# EAGLE design 74181 (EAGLE 9.5.0)
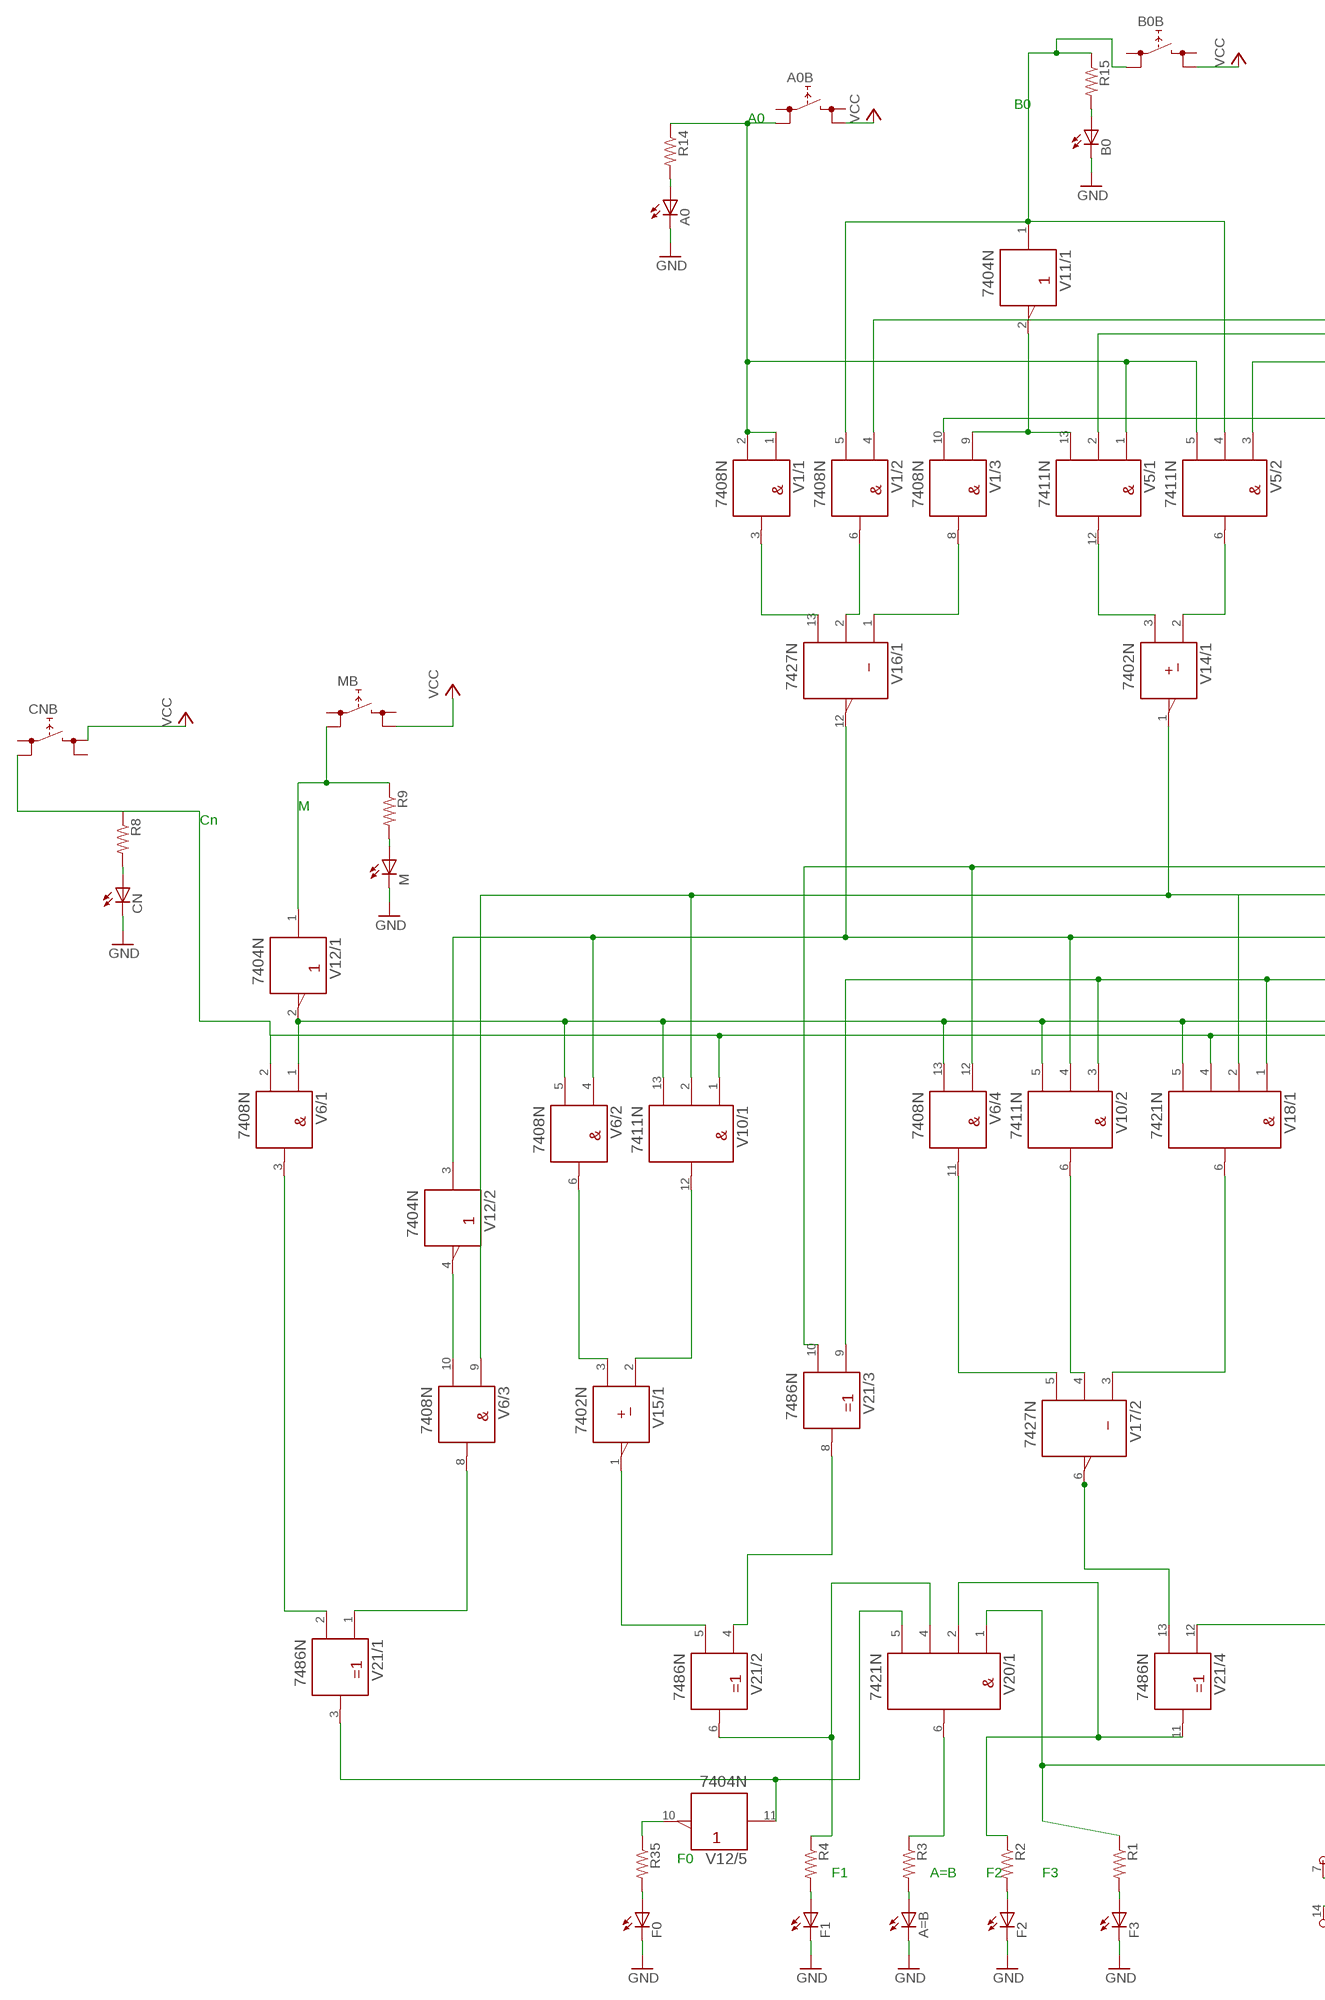
[diagram p0: schematic, sheet 1, part 1 of 2]
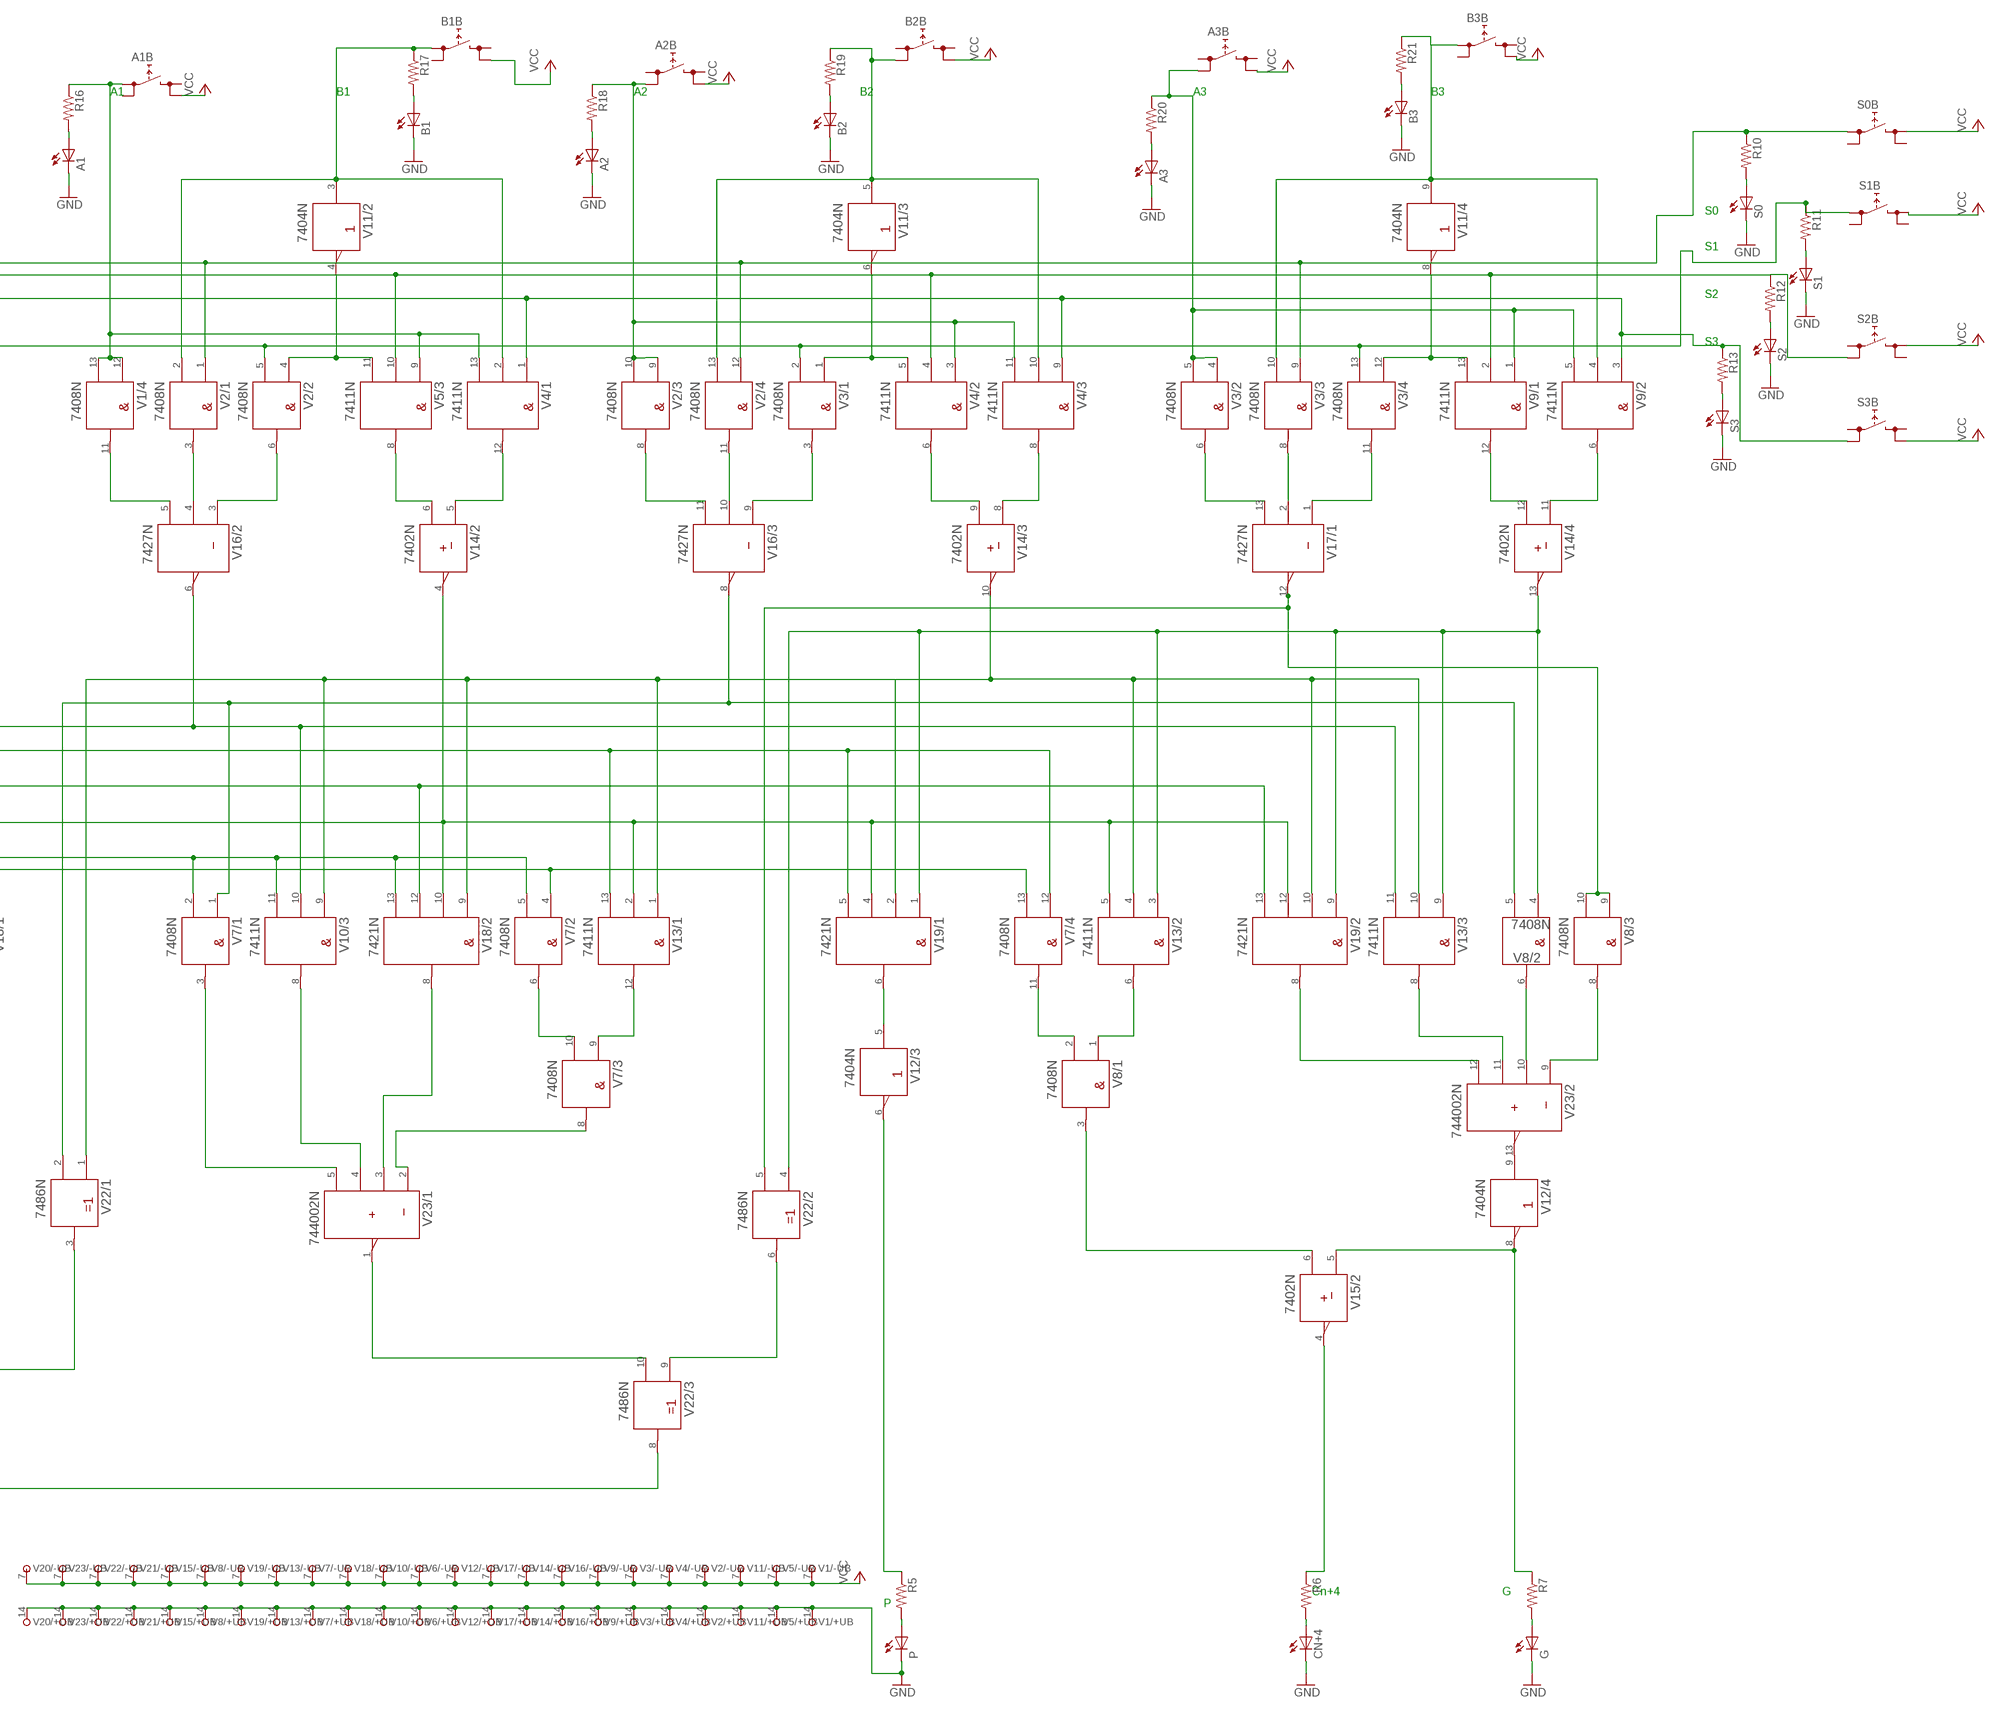
[diagram p1: schematic, sheet 1, part 2 of 2]

## Parts
A0  LEDCHIP-LED0603  [CHIP-LED0603]
A0B  REKN  [REKN]
A1  LEDCHIP-LED0603  [CHIP-LED0603]
A1B  REKN  [REKN]
A2  LEDCHIP-LED0603  [CHIP-LED0603]
A2B  REKN  [REKN]
A3  LEDCHIP-LED0603  [CHIP-LED0603]
A3B  REKN  [REKN]
A=B  LEDCHIP-LED0603  [CHIP-LED0603]
B0  LEDCHIP-LED0603  [CHIP-LED0603]
B0B  REKN  [REKN]
B1  LEDCHIP-LED0603  [CHIP-LED0603]
B1B  REKN  [REKN]
B2  LEDCHIP-LED0603  [CHIP-LED0603]
B2B  REKN  [REKN]
B3  LEDCHIP-LED0603  [CHIP-LED0603]
B3B  REKN  [REKN]
CN  LEDCHIP-LED0603  [CHIP-LED0603]
CN+4  LEDCHIP-LED0603  [CHIP-LED0603]
CNB  REKN  [REKN]
F0  LEDCHIP-LED0603  [CHIP-LED0603]
F1  LEDCHIP-LED0603  [CHIP-LED0603]
F2  LEDCHIP-LED0603  [CHIP-LED0603]
F3  LEDCHIP-LED0603  [CHIP-LED0603]
G  LEDCHIP-LED0603  [CHIP-LED0603]
M  LEDCHIP-LED0603  [CHIP-LED0603]
MB  REKN  [REKN]
P  LEDCHIP-LED0603  [CHIP-LED0603]
R1  R-US_R0603  [R0603]
R2  R-US_R0603  [R0603]
R3  R-US_R0603  [R0603]
R4  R-US_R0603  [R0603]
R5  R-US_R0603  [R0603]
R6  R-US_R0603  [R0603]
R7  R-US_R0603  [R0603]
R8  R-US_R0603  [R0603]
R9  R-US_R0603  [R0603]
R10  R-US_R0603  [R0603]
R11  R-US_R0603  [R0603]
R12  R-US_R0603  [R0603]
R13  R-US_R0603  [R0603]
R14  R-US_R0603  [R0603]
R15  R-US_R0603  [R0603]
R16  R-US_R0603  [R0603]
R17  R-US_R0603  [R0603]
R18  R-US_R0603  [R0603]
R19  R-US_R0603  [R0603]
R20  R-US_R0603  [R0603]
R21  R-US_R0603  [R0603]
R35  R-US_R0603  [R0603]
S0  LEDCHIP-LED0603  [CHIP-LED0603]
S0B  REKN  [REKN]
S1  LEDCHIP-LED0603  [CHIP-LED0603]
S1B  REKN  [REKN]
S2  LEDCHIP-LED0603  [CHIP-LED0603]
S2B  REKN  [REKN]
S3  LEDCHIP-LED0603  [CHIP-LED0603]
S3B  REKN  [REKN]
V1  7408N  [DIL14]
V2  7408N  [DIL14]
V3  7408N  [DIL14]
V4  7411N  [DIL14]
V5  7411N  [DIL14]
V6  7408N  [DIL14]
V7  7408N  [DIL14]
V8  7408N  [DIL14]
V9  7411N  [DIL14]
V10  7411N  [DIL14]
V11  7404N  [DIL14]
V12  7404N  [DIL14]
V13  7411N  [DIL14]
V14  7402N  [DIL14]
V15  7402N  [DIL14]
V16  7427N  [DIL14]
V17  7427N  [DIL14]
V18  7421N  [DIL14]
V19  7421N  [DIL14]
V20  7421N  [DIL14]
V21  7486N  [DIL14]
V22  7486N  [DIL14]
V23  744002N  [DIL14]

## Nets
!F!0: V12.11(/5:A) V20.5(/1:D) V21.3(/1:Y)
GND: A0.C A1.C A2.C A3.C A=B.C B0.C B1.C B2.C B3.C CN+4.C CN.C F0.C F1.C F2.C F3.C G.C M.C P.C S0.C S1.C S2.C S3.C V1.14(/+UB:+UB) V2.14(/+UB:+UB) V3.14(/+UB:+UB) V4.14(/+UB:+UB) V5.14(/+UB:+UB) V6.14(/+UB:+UB) V7.14(/+UB:+UB) V8.14(/+UB:+UB) V9.14(/+UB:+UB) V10.14(/+UB:+UB) V11.14(/+UB:+UB) V12.14(/+UB:+UB) V13.14(/+UB:+UB) V14.14(/+UB:+UB) V15.14(/+UB:+UB) V16.14(/+UB:+UB) V17.14(/+UB:+UB) V18.14(/+UB:+UB) V19.14(/+UB:+UB) V20.14(/+UB:+UB) V21.14(/+UB:+UB) V22.14(/+UB:+UB) V23.14(/+UB:+UB)
N$1: V1.9(/3:A) V5.13(/1:C) V11.2(/1:Y)
N$2: V2.4(/2:A) V5.11(/3:C) V11.4(/2:Y)
N$3: V3.1(/1:A) V4.5(/2:C) V11.6(/3:Y)
N$4: V3.12(/4:A) V9.13(/1:C) V11.8(/4:Y)
N$5: V1.3(/1:Y) V16.13(/1:C)
N$6: V1.6(/2:Y) V16.2(/1:B)
N$7: V1.8(/3:Y) V16.1(/1:A)
N$8: V5.12(/1:Y) V14.3(/1:B)
N$9: V5.6(/2:Y) V14.2(/1:A)
N$10: V1.11(/4:Y) V16.5(/2:C)
N$11: V2.3(/1:Y) V16.4(/2:B)
N$12: V2.6(/2:Y) V16.3(/2:A)
N$13: V5.8(/3:Y) V14.6(/2:B)
N$14: V4.12(/1:Y) V14.5(/2:A)
N$15: V2.8(/3:Y) V16.11(/3:C)
N$16: V2.11(/4:Y) V16.10(/3:B)
N$17: V3.3(/1:Y) V16.9(/3:A)
N$18: V4.6(/2:Y) V14.9(/3:B)
N$19: V4.8(/3:Y) V14.8(/3:A)
N$20: V3.6(/2:Y) V17.13(/1:C)
N$21: V3.8(/3:Y) V17.2(/1:B)
N$22: V3.11(/4:Y) V17.1(/1:A)
N$23: V9.12(/1:Y) V14.12(/4:B)
N$24: V9.6(/2:Y) V14.11(/4:A)
N$25: V6.1(/1:A) V6.5(/2:B) V6.13(/4:B) V7.2(/1:B) V7.5(/2:B) V10.5(/2:C) V10.11(/3:C) V10.13(/1:C) V12.2(/1:Y) V18.5(/1:D) V18.13(/2:D)
N$26: V6.10(/3:B) V12.4(/2:Y)
N$27: R4.1 V20.4(/1:C) V21.6(/2:Y)
N$28: F3.A R1.2
N$29: R2.1 V20.2(/1:B) V21.11(/4:Y)
N$30: R1.1 V20.1(/1:A) V22.8(/3:Y)
N$31: V7.3(/1:Y) V23.5(/1:D)
N$32: V10.8(/3:Y) V23.4(/1:C)
N$33: V18.8(/2:Y) V23.3(/1:B)
N$34: V7.8(/3:Y) V23.2(/1:A)
N$35: V7.6(/2:Y) V7.10(/3:B)
N$36: V7.9(/3:A) V13.12(/1:Y)
N$37: V22.10(/3:B) V23.1(/1:Y)
N$38: V22.6(/2:Y) V22.9(/3:A)
N$39: V12.5(/3:A) V19.6(/1:Y)
N$40: V2.9(/3:A)
N$41: V8.1(/1:A) V13.6(/2:Y)
N$42: V12.9(/4:A) V23.13(/2:Y)
N$43: R7.1 V12.8(/4:Y) V15.5(/2:A)
N$44: V8.3(/1:Y) V15.6(/2:B)
N$45: V19.8(/2:Y) V23.12(/2:D)
N$46: V13.8(/3:Y) V23.11(/2:C)
N$47: V3.4(/2:A)
N$48: V8.8(/3:Y) V23.9(/2:A)
N$49: V6.3(/1:Y) V21.2(/1:B)
N$50: V6.8(/3:Y) V21.1(/1:A)
N$51: V6.6(/2:Y) V15.3(/1:B)
N$52: V10.12(/1:Y) V15.2(/1:A)
N$53: V15.1(/1:Y) V21.5(/2:B)
N$54: V21.4(/2:A) V21.8(/3:Y)
N$55: V21.13(/4:B)
N$56: V21.12(/4:A) V22.3(/1:Y)
N$57: V6.11(/4:Y) V17.5(/2:C)
N$58: V10.6(/2:Y) V17.4(/2:B)
N$59: V17.3(/2:A) V18.6(/1:Y)
N$60: R5.1 V12.6(/3:Y)
N$61: R6.1 V15.4(/2:Y)
N$62: R3.1 V20.6(/1:Y)
N$63: V6.9(/3:A) V7.12(/4:A) V10.2(/1:B) V13.13(/1:C) V14.1(/1:Y) V18.2(/1:B) V19.5(/1:D)
N$64: CNB.0B R8.1 V6.2(/1:B) V7.4(/2:A) V7.13(/4:B) V10.1(/1:A) V18.4(/1:C)
N$65: V6.4(/2:A) V10.4(/2:B) V12.3(/2:A) V16.12(/1:Y) V18.12(/2:C) V19.13(/2:D)
N$66: V6.12(/4:A) V10.10(/3:B) V13.11(/3:C) V16.6(/2:Y) V21.10(/3:B)
N$67: V8.9(/3:A) V8.10(/3:B) V22.5(/2:B)
N$68: A0B.0B R14.1 V1.1(/1:A) V1.2(/1:B) V5.1(/1:A) V5.5(/2:C)
N$69: A1B.0A R16.1 V1.12(/4:A) V1.13(/4:B) V4.13(/1:C) V5.9(/3:A)
N$70: A2B.0B R18.1 V2.10(/3:B) V4.3(/2:A) V4.11(/3:C)
N$71: A3B.0B R20.1 V3.5(/2:B) V9.1(/1:A) V9.5(/2:C)
N$72: V10.3(/2:A) V13.2(/1:B) V13.5(/2:C) V14.4(/2:Y) V18.1(/1:A) V18.10(/2:B) V19.4(/1:C) V19.12(/2:C) V21.9(/3:A)
N$73: V7.1(/1:A) V8.5(/2:B) V16.8(/3:Y) V22.2(/1:B)
N$74: V10.9(/3:A) V13.1(/1:A) V13.4(/2:B) V13.10(/3:B) V14.10(/3:Y) V18.9(/2:A) V19.2(/1:B) V19.10(/2:B) V22.1(/1:A)
N$75: R11.1 S1B.0A V1.10(/3:B) V2.5(/2:B) V3.2(/1:B) V3.13(/4:B)
N$76: R10.1 S0B.0A V1.4(/2:A) V2.1(/1:A) V2.12(/4:A) V3.9(/3:A)
N$77: V8.4(/2:A) V13.3(/2:A) V13.9(/3:A) V14.13(/4:Y) V19.1(/1:A) V19.9(/2:A) V22.4(/2:A)
N$78: MB.0B R9.1 V12.1(/1:A)
N$79: B0B.0B R15.1 V1.5(/2:B) V5.4(/2:B) V11.1(/1:A)
N$80: B1B.0A R17.1 V2.2(/1:B) V4.2(/1:B) V11.3(/2:A)
N$81: B2B.0B R19.1 V2.13(/4:B) V4.10(/3:B) V11.5(/3:A)
N$82: B3B.0A R21.1 V3.10(/3:B) V9.4(/2:B) V11.9(/4:A)
N$83: R13.1 S3B.0B V4.1(/1:A) V4.9(/3:A) V5.3(/2:A) V9.3(/2:A)
N$84: R12.1 S2B.0B V4.4(/2:B) V5.2(/1:B) V5.10(/3:B) V9.2(/1:B)
N$85: V7.11(/4:Y) V8.2(/1:B)
N$86: V8.6(/2:Y) V23.10(/2:B)
N$87: V17.6(/2:Y) V17.12(/1:Y)
N$88: F2.A R2.2
N$89: A=B.A R3.2
N$90: F1.A R4.2
N$91: P.A R5.2
N$92: F0.A R35.2
N$93: CN+4.A R6.2
N$94: G.A R7.2
N$95: CN.A R8.2
N$96: M.A R9.2
N$97: R10.2 S0.A
N$98: R11.2 S1.A
N$99: R12.2 S2.A
N$100: R13.2 S3.A
N$101: A0.A R14.2
N$102: B0.A R15.2
N$103: A1.A R16.2
N$104: B1.A R17.2
N$105: A2.A R18.2
N$106: B2.A R19.2
N$107: A3.A R20.2
N$108: B3.A R21.2
N$109: R35.1 V12.10(/5:Y)
VCC: A0B.1B A1B.1B A2B.1B A3B.1B B0B.1B B1B.1B B2B.1B B3B.1B CNB.1A MB.1B S0B.1A S1B.1A S2B.1A S3B.1B V1.7(/-UB:-UB) V2.7(/-UB:-UB) V3.7(/-UB:-UB) V4.7(/-UB:-UB) V5.7(/-UB:-UB) V6.7(/-UB:-UB) V7.7(/-UB:-UB) V8.7(/-UB:-UB) V9.7(/-UB:-UB) V10.7(/-UB:-UB) V11.7(/-UB:-UB) V12.7(/-UB:-UB) V13.7(/-UB:-UB) V14.7(/-UB:-UB) V15.7(/-UB:-UB) V16.7(/-UB:-UB) V17.7(/-UB:-UB) V18.7(/-UB:-UB) V19.7(/-UB:-UB) V20.7(/-UB:-UB) V21.7(/-UB:-UB) V22.7(/-UB:-UB) V23.7(/-UB:-UB)
Unconnected: A0B.0A A0B.1A A1B.0B A1B.1A A2B.0A A2B.1A A3B.0A A3B.1A B0B.0A B0B.1A B1B.0B B1B.1A B2B.0A B2B.1A B3B.0B B3B.1A CNB.0A CNB.1B MB.0A MB.1A S0B.0B S0B.1B S1B.0B S1B.1B S2B.0A S2B.1B S3B.0A S3B.1A V8.11(/4:Y) V8.12(/4:A) V8.13(/4:B) V9.8(/3:Y) V9.9(/3:A) V9.10(/3:B) V9.11(/3:C) V11.10(/5:Y) V11.11(/5:A) V11.12(/6:Y) V11.13(/6:A) V12.12(/6:Y) V12.13(/6:A) V15.8(/3:A) V15.9(/3:B) V15.10(/3:Y) V15.11(/4:A) V15.12(/4:B) V15.13(/4:Y) V17.8(/3:Y) V17.9(/3:A) V17.10(/3:B) V17.11(/3:C) V20.8(/2:Y) V20.9(/2:A) V20.10(/2:B) V20.12(/2:C) V20.13(/2:D) V22.11(/4:Y) V22.12(/4:A) V22.13(/4:B)

## Notes on the sheet
- B0
- A0 | A1 | B1 | A2 | B2 | A3 | B3
- S0
- S1
- S2
- S3
- M
- Cn
- F0
- F1 | A=B | F2 | F3
- Cn+4 | G
- P

## Library data of the parts
A0 A1-A3 A=B B0 B1-B3 CN CN+4 F0 F1-F3 G M P S0 S1-S3 = led:LED: LED OSRAM: - CHIPLED LG R971, LG N971, LY N971, LG Q971, LY Q971, LO R971, LY R971 LH N974, LH R974 LS Q976, LO Q976, LY Q976 LO Q996 - Hyper CHIPLED LW Q18S LB Q993, LB Q99A, LB R99A - SideLED LS A670, LO A670, LY A670, LG A670, LP A670 LB A673, LV A673, LT A673, LW A673 LH A674 LY A675 LS A676, LA A676, LO A676, LY A676, LW A676 LS A679, LY A679, LG A679 - Hyper Micro SIDELED® LS Y876, LA Y876, LO Y876, LY Y876 LT Y87S - SmartLED LW L88C, LW L88S LB L89C, LB L89S, LG L890 LS L89K, LO L89K, LY L89K LS L896, LA L896, LO L896, LY L896 - TOPLED LS T670, LO T670, LY T670, LG T670, LP T670 LSG T670, LSP T670, LSY T670, LOP T670, LYG T670 LG T671, LOG T671, LSG T671 LB T673, LV T673, LT T673, LW T673 LH T674 LS T676, LA T676, LO T676, LY T676, LB T676, LH T676, LSB T676, LW T676 LB T67C, LV T67C, LT T67C, LS T67K, LO T67K, LY T67K, LW E67C LS E67B, LA E67B, LO E67B, LY E67B, LB E67C, LV E67C, LT E67C LW T67C LS T679, LY T679, LG T679 LS T770, LO T770, LY T770, LG T770, LP T770 LB T773, LV T773, LT T773, LW T773 LH T774 LS E675, LA E675, LY E675, LS T675 LS T776, LA T776, LO T776, LY T776, LB T776 LHGB T686 LT T68C, LB T68C - Hyper Mini TOPLED® LB M676 - Mini TOPLED Santana® LG M470 LS M47K, LO M47K, LY M47K Source: http://www.osram.convergy.de LUXEON: - LUMILED® LXK2-PW12-R00, LXK2-PW12-S00, LXK2-PW14-U00, LXK2-PW14-V00 LXK2-PM12-R00, LXK2-PM12-S00, LXK2-PM14-U00 LXK2-PE12-Q00, LXK2-PE12-R00, LXK2-PE12-S00, LXK2-PE14-T00, LXK2-PE14-U00 LXK2-PB12-K00, LXK2-PB12-L00, LXK2-PB12-M00, LXK2-PB14-N00, LXK2-PB14-P00, LXK2-PB14-Q00 LXK2-PR12-L00, LXK2-PR12-M00, LXK2-PR14-Q00, LXK2-PR14-R00 LXK2-PD12-Q00, LXK2-PD12-R00, LXK2-PD12-S00 LXK2-PH12-R00, LXK2-PH12-S00 LXK2-PL12-P00, LXK2-PL12-Q00, LXK2-PL12-R00 Source: www.luxeon.com KINGBRIGHT: KA-3528ASYC Source: www.kingbright.com
A0B A1B A2B A3B B0B B1B B2B B3B CNB MB S0B S1B S2B S3B = switch:REKN: PUSH SWITCH ITT-Cannon-Cannon
R1-R21 R35 = resistor:R-US_: RESISTOR, American symbol
V1-V3 V6-V8 = 74ttl-din:74*08: Quad 2-input AND gate
V4 V5 V9 V10 V13 = 74ttl-din:74*11: Triple 3-input AND gate
V11 V12 = 74ttl-din:74*04: Hex INVERTER
V14 V15 = 74ttl-din:74*02: Quad 2-input NOR gate
V16 V17 = 74ttl-din:74*27: Triple 3-input NOR gate
V18-V20 = 74ttl-din:74*21: Dual 4-input AND gate
V21 V22 = 74ttl-din:74*86: Quad 2-input EXCLUSIV-OR gate
V23 = 74ttl-din:74*4002: Dual 4-input NOR

## Board
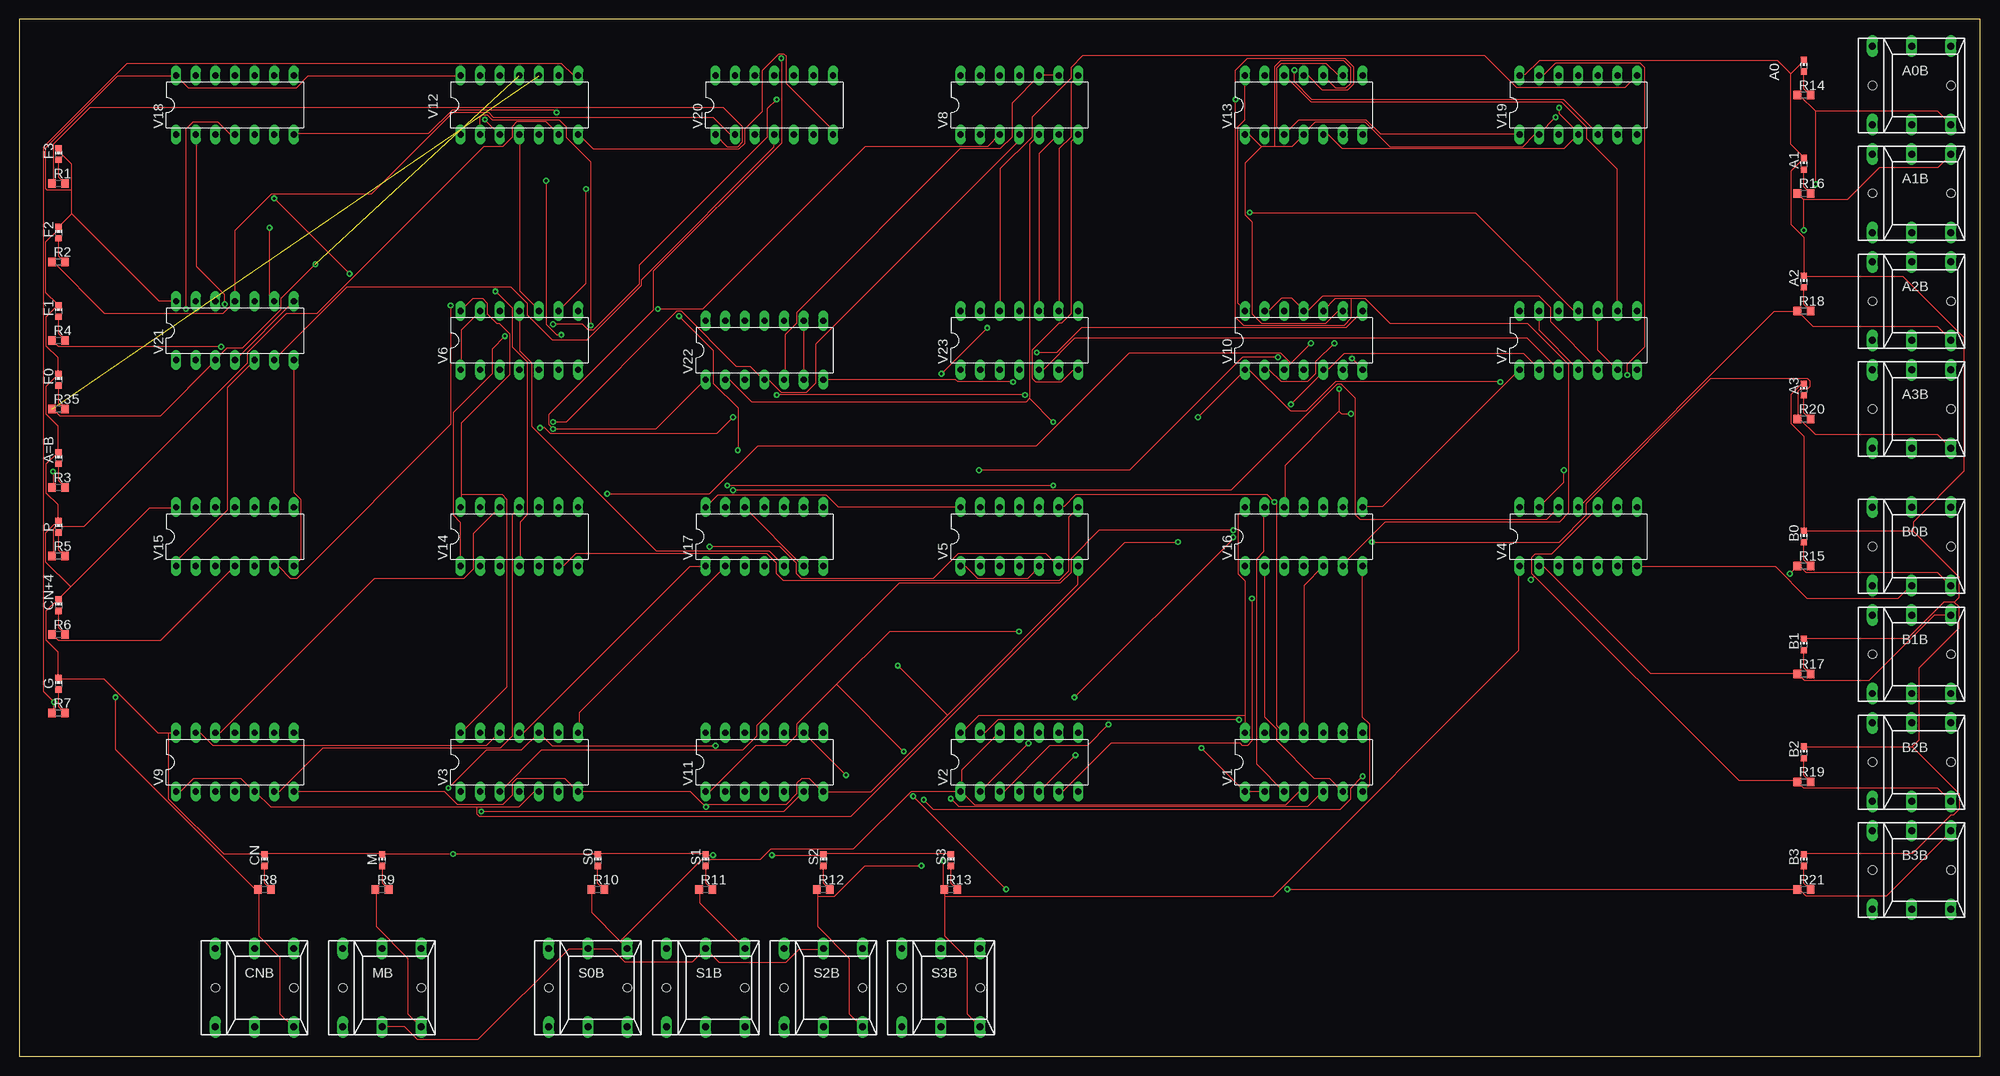
[diagram p2: board, top side]
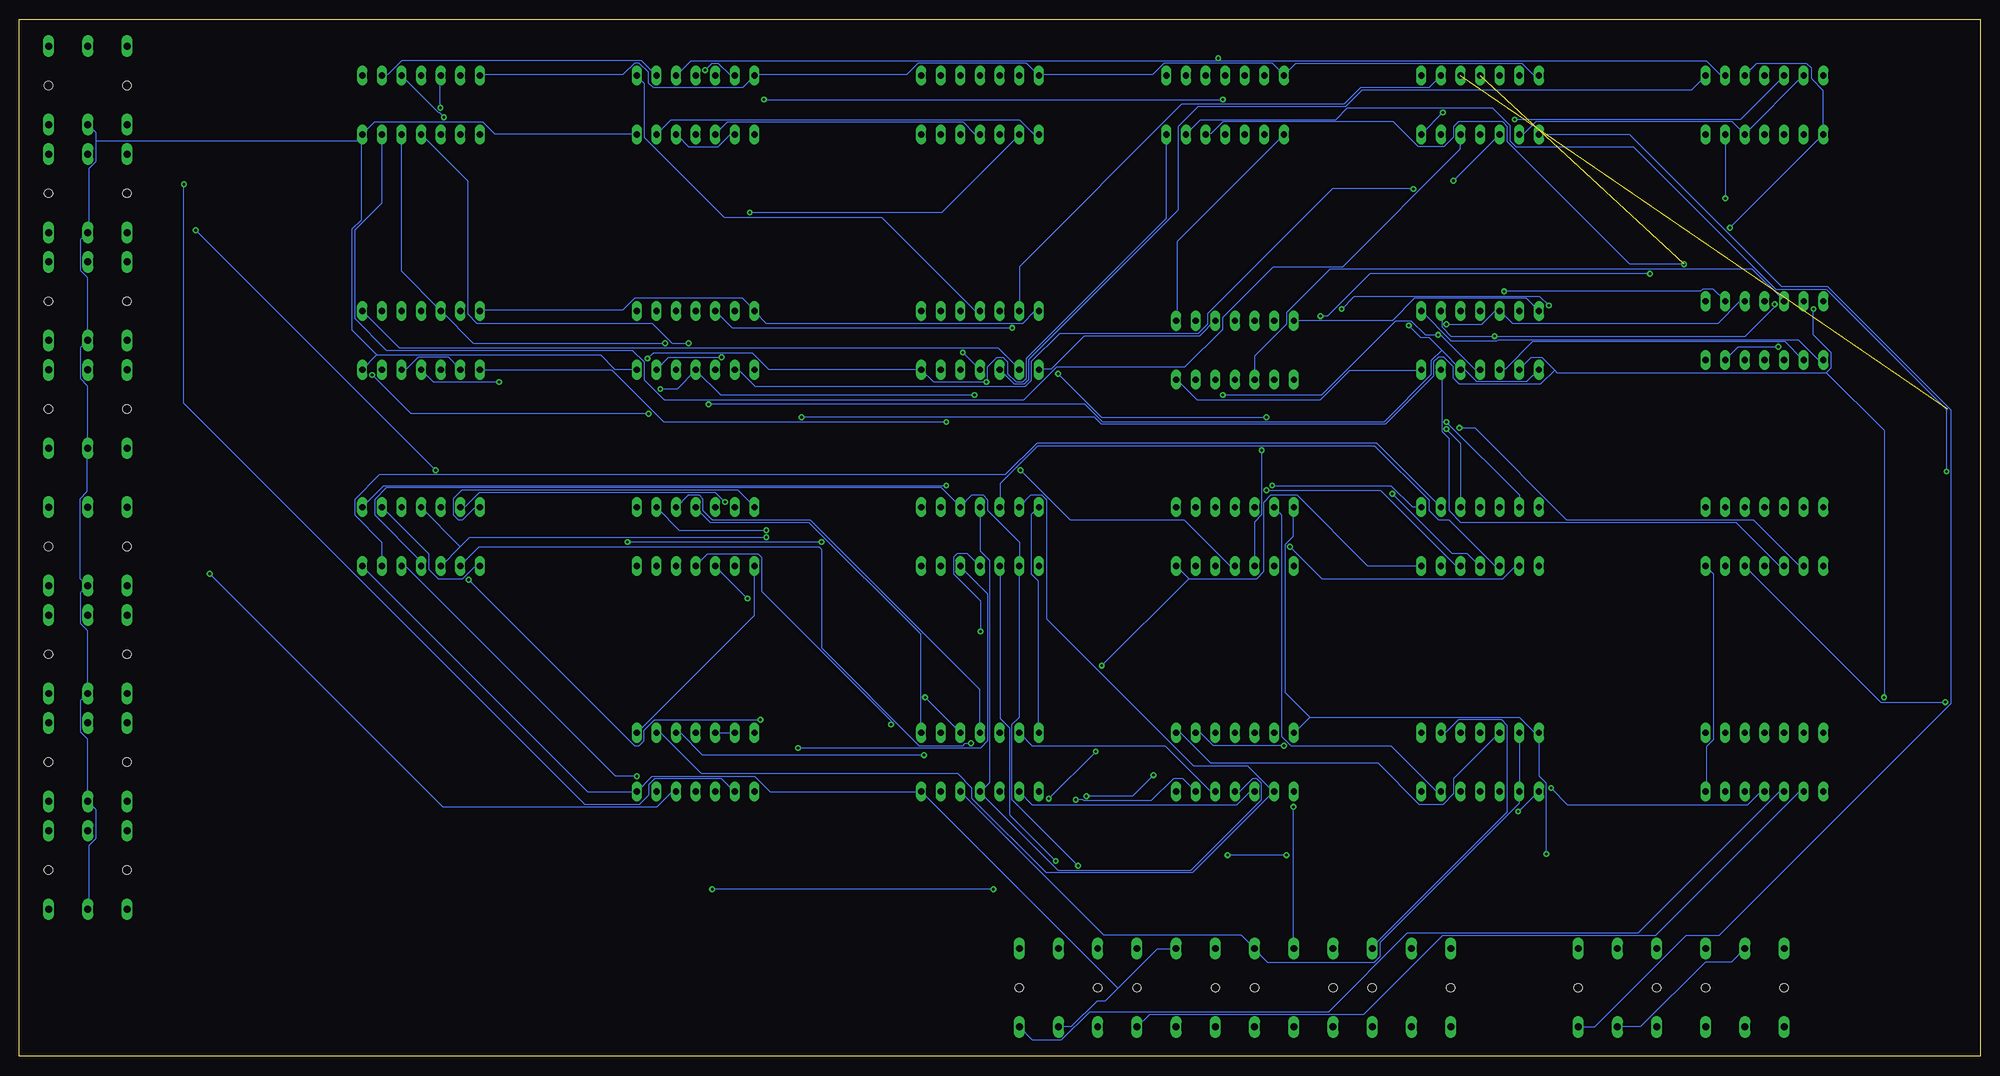
[diagram p3: board, bottom side, seen from below]

Size 253.98 x 134.29 mm. Coordinates in mm from the lower left corner, seen from the top.
Outline: 0,0 253.98,0 253.98,134.29 0,134.29 0,0
Copper layers (1+2*15+16): Top 0.035mm / dielectric 1.5mm / Route2 0.035mm / dielectric 0.15mm / Route15 0.035mm / dielectric 0.2mm / Bottom 0.035mm
Design rules "default *": minimum track width 6mil, minimum drill 0.35mm, track to track 6mil, track to pad 6mil, pad to pad 6mil, via to via 6mil, smd to smd 6mil, copper to edge 40mil, drill to drill 6mil, minimum pad ring 10mil, minimum via ring 8mil, stop-mask expansion 4mil, vias tented up to drill 0mil, thermal gap 10mil

### Footprints (pad centres in the part's own frame; a part is rotated, then mirrored left to right if it is on the bottom)
CHIP-LED0603 = smd 0.8 x 0.8: A 0,-0.75; C 0,0.75
REKN = drill 0.9 long: 0A 5.08,5.08; 0B 5.08,-5.08; 1A 0,5.08; 1B 0,-5.08; A -5.08,5.08; B -5.08,-5.08 | hole 1.1: -5.08,0; 5.08,0
R0603 = smd 1 x 1.1: 1 -0.85,0; 2 0.85,0
DIL14 = drill 0.813 long: 1 -7.62,-3.81; 2 -5.08,-3.81; 3 -2.54,-3.81; 4 0,-3.81; 5 2.54,-3.81; 6 5.08,-3.81; 7 7.62,-3.81; 8 7.62,3.81; 9 5.08,3.81; 10 2.54,3.81; 11 0,3.81; 12 -2.54,3.81; 13 -5.08,3.81; 14 -7.62,3.81

### Placement (x,y rotation side)
A0  231.14,128.27 0 top
A0B  245.11,125.73 0 top
A1  231.14,115.57 0 top
A1B  245.11,111.76 0 top
A2  231.14,100.33 0 top
A2B  245.11,97.79 0 top
A3  231.14,86.36 0 top
A3B  245.11,83.82 0 top
A=B  5.08,77.47 0 top
B0  231.14,67.31 0 top
B0B  245.11,66.04 0 top
B1  231.14,53.34 0 top
B1B  245.11,52.07 0 top
B2  231.14,39.37 0 top
B2B  245.11,38.1 0 top
B3  231.14,25.4 0 top
B3B  245.11,24.13 0 top
CN  31.75,25.4 0 top
CN+4  5.08,58.42 0 top
CNB  30.48,8.89 0 top
F0  5.08,87.63 0 top
F1  5.08,96.52 0 top
F2  5.08,106.68 0 top
F3  5.08,116.84 0 top
G  5.08,48.26 0 top
M  46.99,25.4 0 top
MB  46.99,8.89 0 top
P  5.08,68.58 0 top
R1  5.08,113.03 0 top
R2  5.08,102.87 0 top
R3  5.08,73.66 0 top
R4  5.08,92.71 0 top
R5  5.08,64.77 0 top
R6  5.08,54.61 0 top
R7  5.08,44.45 0 top
R8  31.75,21.59 0 top
R9  46.99,21.59 0 top
R10  74.93,21.59 0 top
R11  88.9,21.59 0 top
R12  104.14,21.59 0 top
R13  120.65,21.59 0 top
R14  231.14,124.46 0 top
R15  231.14,63.5 0 top
R16  231.14,111.76 0 top
R17  231.14,49.53 0 top
R18  231.14,96.52 0 top
R19  231.14,35.56 0 top
R20  231.14,82.55 0 top
R21  231.14,21.59 0 top
R35  5.08,83.82 0 top
S0  74.93,25.4 0 top
S0B  73.66,8.89 0 top
S1  88.9,25.4 0 top
S1B  88.9,8.89 0 top
S2  104.14,25.4 0 top
S2B  104.14,8.89 0 top
S3  120.65,25.4 0 top
S3B  119.38,8.89 0 top
V1  166.37,38.1 0 top
V2  129.54,38.1 0 top
V3  64.77,38.1 0 top
V4  201.93,67.31 0 top
V5  129.54,67.31 0 top
V6  64.77,92.71 0 top
V7  201.93,92.71 0 top
V8  129.54,123.19 0 top
V9  27.94,38.1 0 top
V10  166.37,92.71 0 top
V11  96.52,38.1 0 top
V12  64.77,123.19 0 top
V13  166.37,123.19 0 top
V14  64.77,67.31 0 top
V15  27.94,67.31 0 top
V16  166.37,67.31 0 top
V17  96.52,67.31 0 top
V18  27.94,123.19 0 top
V19  201.93,123.19 0 top
V20  97.79,123.19 0 top
V21  27.94,93.98 0 top
V22  96.52,91.44 0 top
V23  129.54,92.71 0 top

### Tracks (layer width: path | path; a pad name or v marks a point on that pad's centre or on a via)
!F!0  (via drill 0.35)  (1 unrouted)
  Top 0.152: 4.37,83.82 5.28,82.91 18.24,82.91 25.4,90.07 V21.3 25.4,90.22 26.92,91.75 28.91,91.75 33.93,96.77 33.93,98.15 v38.35,102.56
  Bottom 0.152: v38.35,102.56 45.36,102.56 61.21,118.42 61.21,120.4 61.82,121.01 67.61,121.01 68.22,120.4 68.22,119.02 69.44,117.81 72.8,117.81 76,121.01 98.09,121.01 99.62,119.48 100.23,119.48 V20.5
GND  (via drill 0.35)
  Top 0.152: A3.C 231.14,87.02 230.83,87.02 229.46,85.65 229.46,81.99 231.14,80.31 B0.C 231.14,67.97 245.31,67.97 | 245.16,40.08 251.26,33.98 251.26,32 250.5,31.24 250.19,31.24 245.16,26.21 231.14,26.21 B3.C | 245.16,40.08 231.14,40.08 B2.C | 250.65,58.83 249.28,58.83 244.55,54.1 231.14,54.1 B1.C | 250.65,58.83 251.26,58.22 251.26,55.47 246.07,50.29 246.07,41 245.16,40.08 | 245.31,67.97 251.26,62.03 251.26,59.44 250.65,58.83 | 229.46,127.25 231.14,128.93 A0.C | 229.46,127.25 229.46,118.11 231.14,116.43 A1.C 231.14,116.28 229.46,114.61 229.46,107.75 231.14,106.07 A2.C 231.14,101.04 243.94,101.04 251.87,93.12 251.87,75.74 245.31,69.19 245.31,67.97 | 229.46,127.25 227.79,128.93 196.85,128.93 195.02,127.1 194.41,127.1 V19.14 | V13.14 158.75,121.31 157.84,120.4 157.84,97.54 158.75,96.62 V10.14 | 158.75,44.2 158.75,61.57 157.84,62.48 157.84,70.1 158.75,71.02 V16.14 | 158.75,44.2 V1.14 | 57.25,72.7 57.25,81.99 63.5,88.24 63.5,93.57 62.13,94.95 61.82,94.95 60.6,96.16 60.6,97.54 59.99,98.15 58.78,98.15 V6.14 | 57.25,72.7 57.25,71.17 V14.14 | V17.14 90.47,72.7 104.5,72.7 106.02,71.17 121.87,71.17 V5.14 | 57.25,72.7 62.59,72.7 63.2,72.08 63.2,47.85 57.25,41.91 V3.14 | 158.75,44.2 124.31,44.2 122.02,41.91 V2.14 | S3.C 120.65,26.21 104.19,26.21 S2.C 104.04,26.06 v97.48,26.06 | 74.93,26.21 88.8,26.21 S1.C 88.95,26.06 v89.87,26.06 | 74.93,26.21 v56.19,26.21 47.04,26.21 M.C 46.89,26.21 31.8,26.21 CN.C 31.65,26.21 26.47,26.21 19.3,33.38 19.3,41.91 | 74.93,26.21 S0.C | 19.3,41.91 17.93,41.91 10.92,48.92 5.13,48.92 G.C 4.98,49.07 4.98,52.43 3.45,53.95 3.45,57.61 4.98,59.13 CN+4.C 5.13,59.28 6.66,60.81
  Top 0.152: 19.3,41.91 V9.14 | 6.66,60.81 16.87,71.02 20.22,71.02 V15.14 | 6.66,60.81 3.45,64.01 3.45,67.82 4.52,68.89 4.67,68.89 4.98,69.19 P.C 4.98,69.34 4.98,71.48 3.45,73 3.45,76.66 4.98,78.18 A=B.C 4.98,78.33 4.98,81.69 3.45,83.21 3.45,86.72 4.98,88.24 F0.C 4.98,88.39 4.98,90.53 3.45,92.05 3.45,95.71 4.98,97.23 F1.C 4.98,97.38 3.45,98.91 3.45,105.46 4.98,106.98 4.98,107.29 F2.C 5.13,107.44 6.81,109.12 | 6.81,109.12 6.81,112.17 | 6.81,112.17 6.81,115.52 5.13,117.2 5.13,117.5 F3.C | 6.81,109.12 18.09,97.84 20.22,97.84 V21.14 | 6.81,112.17 3.61,112.17 3.45,112.32 3.45,117.65 12.75,126.95 20.22,126.95 V18.14 21.89,125.42 35.92,125.42 37.44,126.95 57.1,126.95 V12.14
  Bottom 0.152: V23.14 122.02,96.47 122.48,96.47 124,94.95 157.23,94.95 158.75,96.47 V10.14 158.75,96.62 160.27,98.15 174.29,98.15 175.82,96.62 194.26,96.62 V7.14 | V19.14 194.26,127.1 175.82,127.1 174.29,128.63 173.69,128.63 172.47,127.41 172.47,126.04 171.86,125.42 160.27,125.42 158.75,126.95 V13.14 158.75,127.1 139.09,127.1 137.57,128.63 123.55,128.63 V8.14 121.87,127.1 107.24,127.1 105.72,128.63 91.69,128.63 90.17,127.1 | V4.14 194.41,71.02 195.02,71.02 196.54,69.49 197.16,69.49 197.76,70.1 197.76,72.24 196.7,73.3 160.88,73.3 158.75,71.17 V16.14 | V22.14 76.15,95.25 73.25,98.15 58.78,98.15 V6.14 | V5.14 122.94,70.1 122.94,62.48 122.02,61.57 122.02,41.91 V2.14 | 86.82,43.89 59.69,43.89 57.71,41.91 V3.14 57.1,41.91 57.1,36.27 56.19,35.36 v56.19,26.21 | 86.82,43.89 88.8,41.91 V11.14 | 86.82,43.89 90.02,47.09 90.02,66.29 88.95,67.36 88.95,71.02 V17.14 | v89.87,26.06 v97.48,26.06 | 90.17,127.1 88.65,128.63 59.38,128.63 57.86,127.1 57.25,127.1 V12.14 | 90.17,127.1 V20.14
N$1
  Bottom 0.152: 91.54,34.29 94.89,37.64 101.91,37.64 120.96,56.69 120.96,72.08 121.56,72.7 122.94,72.7 124.46,71.17 V5.13 | V1.9 170.94,41.91 165.61,36.58 132.38,36.58 130.56,34.75 130.56,33.38 120.96,23.77 102.06,23.77 91.54,34.29 | 91.54,34.29 V11.2
N$2
  Bottom 0.152: V11.4 95.96,34.29 94.28,35.97 93.67,35.97 93.07,35.36 93.07,33.22 102.21,24.08 119.43,24.08 129.64,34.29 V2.4 129.49,34.29 128.27,35.51 128.27,64.16 129.49,65.38 129.49,71.02 V5.11
N$3  (via drill 0.35)
  Top 0.152: v59.84,31.7 99.01,31.7 V11.6 | v173.99,36.27 172.47,34.75 172.47,33.38 171.09,32 118.36,32 v117.15,33.22
  Bottom 0.152: v59.84,31.7 57.25,34.29 V3.1 | v173.99,36.27 176.73,36.27 203.86,63.4 204.47,63.4 V4.5 | v117.15,33.22 116.23,33.22 116.08,33.07 107.39,33.07 104.5,35.97 103.28,35.97 V11.6
N$4
  Top 0.152: V9.13 23.42,41.91 25.09,40.23 60.45,40.23 62.13,41.91 V3.12
  Bottom 0.152: V11.8 103.58,41.91 99.62,37.95 77.98,37.95 72.64,32.61 69.6,32.61 68.22,33.98 68.22,35.97 62.28,41.91 V3.12
N$5
  Top 0.152: V16.13 161.19,71.02 161.19,65.38 160.27,64.47 160.27,37.8 163.78,34.29 V1.3
N$6
  Top 0.152: V16.2 161.34,63.4 161.34,43.89 162.87,42.37 162.87,40.84 167.74,35.97 169.72,35.97 171.4,34.29 V1.6
N$7
  Bottom 0.152: V16.1 158.75,57.15 V1.8
N$8
  Bottom 0.152: V14.3 62.28,63.55 62.89,63.55 68.83,69.49 70.21,69.49 71.42,70.71 71.42,72.08 78.44,79.1 122.02,79.1 126.9,74.22 126.9,71.17 V5.12
N$9  (via drill 0.35)
  Top 0.152: v89.41,65.99 98.55,65.99 100.69,63.86 100.69,62.48 101.3,61.87 118.36,61.87 121.56,65.08 132.99,65.08 134.52,63.55 V5.6
  Bottom 0.152: v89.41,65.99 85.29,61.87 61.82,61.87 60.3,63.4 59.69,63.4 V14.2
N$10
  Top 0.152: V1.11 166.37,60.96 V16.5
N$11  (via drill 0.35)
  Top 0.152: V2.3 127.51,34.29 133.45,40.23 138.33,40.23 v141.07,42.98
  Bottom 0.152: v141.07,42.98 141.07,43.43 157.84,60.2 157.84,64.62 158.29,65.08 164.85,65.08 166.37,63.55 V16.4
N$12  (via drill 0.35)
  Top 0.152: V2.6 135.13,34.29 141.38,40.54 158.14,40.54 158.44,40.23 159.06,40.23 159.66,40.84 v159.66,59.28
  Bottom 0.152: v159.66,59.28 163.78,63.4 V16.3
N$13
  Top 0.152: V14.6 69.9,63.55 70.51,63.55 72.03,65.08 96.88,65.08 98.09,63.86 98.09,62.48 99.01,61.57 134.67,61.57 135.89,62.79 135.89,69.8 137.11,71.02 V5.8
N$14  (via drill 0.35)
  Top 0.152: v92.46,73.3 156.92,73.3 170.64,87.02 171.25,87.02 173.08,85.19 173.08,70.1 173.69,69.49 197.76,69.49 V4.12
  Bottom 0.152: v92.46,73.3 77.67,73.3 67.92,63.55 67.31,63.55 V14.5
N$15
  Bottom 0.152: V2.8 137.26,41.91 137.26,54.71 151.74,69.19 164.54,69.19 166.37,71.02 V16.11
N$16
  Bottom 0.152: V2.11 129.64,41.91 129.64,47.55 151.59,69.49 164.24,69.49 165.46,70.71 165.46,72.24 165.91,72.7 167.28,72.7 168.81,71.17 V16.10
N$17  (via drill 0.35)
  Top 0.152: v157.23,68.12 139.85,68.12 136.19,64.47 136.19,62.64 134.82,61.27 113.94,61.27 95.5,42.82 95.5,41.45 93.67,39.62 67.61,39.62 62.28,34.29 V3.3
  Bottom 0.152: v157.23,68.12 168.5,68.12 171.4,71.02 V16.9
N$18
  Bottom 0.152: V14.9 78.13,79.4 122.17,79.4 126.29,75.29 207.37,75.29 210.57,72.08 210.57,70.1 207.06,66.6 207.06,63.55 V4.6
N$19  (via drill 0.35)
  Top 0.152: v133.91,73.91 v91.69,73.91
  Bottom 0.152: v91.69,73.91 76.3,73.91 73.56,71.17 72.49,71.17 V14.8 | v133.91,73.91 206.76,73.91 V4.8
N$20
  Bottom 0.152: V3.6 70.36,34.29 76.3,40.23 89.26,40.23 90.47,41.45 90.47,70.1 91.39,71.02 V17.13
N$21
  Top 0.152: V3.8 72.49,41.91 72.49,44.5 91.39,63.4 V17.2
N$22
  Top 0.152: V3.11 65.33,41.91 86.82,63.4 88.8,63.4 V17.1
N$23
  Top 0.152: V9.12 26.01,41.91 45.97,61.87 57.56,61.87 58.78,63.09 58.78,67.67 V14.12
N$24
  Top 0.152: V9.6 33.63,34.29 39.27,39.93 62.28,39.93 63.8,41.45 63.8,70.1 64.72,71.02 V14.11
N$25  (via drill 0.35)
  Top 0.152: 166.37,96.62 164.85,98.15 163.47,98.15 161.95,96.62 161.34,96.62 V10.13 | V7.2 196.85,89 194.87,90.98 171.55,90.98 169.57,89 168.96,89 V10.5 168.81,88.85 168.81,88.54 v164.69,84.43 | 166.37,96.62 166.98,96.62 168.81,98.45 196.85,98.45 198.37,96.93 198.37,95.1 204.47,89 V7.5 | 166.37,96.62 V10.11 | V6.1 57.25,89 57.25,94.03 59.69,96.47 V6.13 | v74.02,94.64 74.02,115.82 70.81,119.02 70.81,120.4 69.9,121.31 61.21,121.31 60.6,121.92 59.99,121.92 59.69,121.62 V12.2
  Bottom 0.152: V7.5 204.47,89 203.86,89 202.34,90.53 198.37,90.53 196.85,89 V7.2 | V6.1 57.25,88.85 58.78,87.33 65.18,87.33 66.7,88.85 67.31,88.85 V6.5 67.31,89 69.75,91.44 | V18.13 22.96,126.95 30.43,119.48 V18.5 32.11,121.01 57.56,121.01 59.08,119.48 59.69,119.48 V12.2 | 69.75,91.44 71.42,93.12 72.49,93.12 v74.02,94.64 | v164.69,84.43 115.93,84.43 113.64,82.14 77.22,82.14 71.12,88.24 71.12,90.07 69.75,91.44
N$26
  Top 0.152: V12.4 64.87,119.33 64.87,99.06 67.31,96.62 V6.10
N$27  (via drill 0.35)
  Top 0.152: v26.16,91.9 5.13,91.9 4.37,92.66 R4.1 | V20.4 97.79,117.81 80.57,100.58 80.57,99.82 73.56,92.81 68.99,92.81 65.79,96.01 65.79,97.54 63.65,99.67 42.47,99.67 33.02,90.22 V21.6
  Bottom 0.152: v26.16,91.9 31.34,91.9 33.02,90.22 V21.6
N$28
  Top 0.152: F3.A 5.13,115.98 5.13,113.84 5.89,113.08 R1.2
N$29
  Top 0.152: R2.1 4.37,102.87 11.07,96.16 26.31,96.16 V21.11 27.99,97.84 27.99,106.98 32.72,111.71 45.67,111.71 56.19,122.23 60.76,122.23 61.37,121.62 89.87,121.62 92,119.48 92.61,119.48 V20.2
N$30
  Top 0.152: R1.1 4.37,113.08 4.37,118.11 9.09,122.83 91.24,122.83 93.67,120.4 93.67,118.42 93.07,117.81 91.69,117.81 90.17,119.33 V20.1
  Bottom 0.152: V22.8 104.04,95.25 104.04,105.46 90.17,119.33 V20.1
N$31
  Top 0.152: V7.3 195.33,92.96 136.65,92.96 132.69,89 132.08,89 V23.5
N$32  (via drill 0.35)
  Top 0.152: v131.78,91.14 134.37,91.14 137.57,94.34 171.86,94.34 173.99,96.47 V10.8
  Bottom 0.152: v131.78,91.14 V23.4
N$33
  Bottom 0.152: V18.8 37.44,125.12 80.11,125.12 82.25,122.99 101.3,122.99 103.89,120.4 103.89,109.58 123.24,90.22 123.24,87.63 123.85,87.02 125.07,87.02 126.9,88.85 V23.3
N$34
  Bottom 0.152: V7.8 204.78,91.75 127.2,91.75 124.46,89 V23.2
N$35
  Top 0.152: V7.10 204.47,91.44 V7.6
N$36
  Top 0.152: V7.9 206.91,96.62 206.91,114.91 202.95,118.87 202.95,120.4 199.75,123.6 167.28,123.6 163.93,126.95 V13.12
N$37
  Bottom 0.152: V23.1 121.87,89 120.34,89 116.08,93.27 101.14,93.27 99.16,95.25 V22.10
N$38
  Top 0.152: V22.9 V22.6
N$39
  Bottom 0.152: V12.5 67.31,117.5 82.55,102.26 91.54,102.26 98.09,95.71 98.09,94.18 102.97,89.31 119.58,89.31 123.85,85.04 170.49,85.04 173.08,87.63 173.08,89.92 174.6,91.44 206.45,91.44 210.57,95.56 210.57,106.98 207.06,110.49 207.06,119.33 V19.6
N$41
  Bottom 0.152: V8.1 122.02,119.48 122.63,119.48 124.46,121.31 169.57,121.31 171.4,119.48 V13.6
N$42
  Bottom 0.152: V23.13 124.46,102.26 103.43,123.29 82.4,123.29 80.26,125.42 71.42,125.42 V12.9
N$43  (via drill 0.35)
  Top 0.152: R7.1 4.37,44.5 4.37,45.72 v4.52,45.87 3.15,47.24 3.15,117.81 13.97,128.63 70.21,128.63 71.73,127.1 72.34,127.1 V12.8
  Bottom 0.152: v4.52,45.87 12.9,45.87 30.43,63.4 V15.5
N$44  (via drill 0.35)
  Top 0.152: v55.88,97.23 55.88,81.84 35.92,61.87 35.15,61.87 33.63,63.4 33.02,63.4 V15.6 | v82.7,96.77 88.49,96.77 109.53,117.81 125.37,117.81 126.9,119.33 V8.3
  Bottom 0.152: v55.88,97.23 57.1,98.45 81.03,98.45 v82.7,96.77
N$45
  Top 0.152: V19.8 207.97,125.42 193.95,125.42 189.84,129.54 137.72,129.54 136.19,128.02 136.19,126.64 131.17,121.62 131.17,119.02 127.05,114.91 127.05,96.62 V23.12
N$46
  Bottom 0.152: V23.11 129.64,96.62 130.25,96.62 142.29,108.66 162.71,108.66 173.08,119.02 173.08,126.04 173.99,126.95 V13.8
N$48
  Top 0.152: V8.8 136.19,126.04 136.19,119.02 134.67,117.5 134.67,96.62 V23.9
N$49
  Bottom 0.152: V6.3 62.13,89 61.52,89 58.01,92.51 25.25,92.51 22.96,90.22 V21.2
N$50
  Bottom 0.152: V6.8 68.53,92.66 62.59,92.66 62.43,92.81 23.57,92.81 20.98,90.22 20.37,90.22 V21.1
N$51
  Bottom 0.152: V15.3 25.4,63.55 26.01,63.55 31.65,69.19 67.31,69.19 68.83,70.71 68.83,80.01 69.75,80.92 69.75,88.85 V6.6
N$52  (via drill 0.35)
  Top 0.152: v67.46,81.38 68.07,81.38 68.83,80.62 90.32,80.62 v92.46,82.75 | v125.37,94.34 v119.43,88.39
  Bottom 0.152: v67.46,81.38 65.48,81.38 53.59,69.49 29.36,69.49 23.42,63.55 22.96,63.55 V15.2 | v92.46,82.75 113.79,82.75 v119.43,88.39 | v125.37,94.34 161.65,94.34 V10.12
N$53
  Top 0.152: V15.1 20.37,63.55 20.37,64.16 26.92,70.71 26.92,86.56 30.43,90.07 V21.5
N$54
  Top 0.152: V21.8 V21.4
N$56
  Bottom 0.152: V22.3 93.98,90.68 89.87,94.79 89.87,96.32 84.23,101.96 29.52,101.96 25.4,97.84 V21.12
N$57
  Top 0.152: V17.5 97.18,65.38 82.55,65.38 66.4,81.53 66.4,89.76 64.87,91.29 64.87,96.47 V6.11
N$58  (via drill 0.35)
  Top 0.152: v124.31,75.89 143.81,75.89 158.44,90.53 v163.02,90.53
  Bottom 0.152: v124.31,75.89 117.91,69.49 103.12,69.49 97.18,63.55 96.57,63.55 V17.4 | v163.02,90.53 169.88,90.53 171.4,89 V10.6
N$59  (via drill 0.35)
  Top 0.152: v93.07,78.49 93.07,83.97 89.87,87.17 89.87,91.44 v85.45,95.86 | v33.02,111.1 v42.77,101.35
  Bottom 0.152: V17.3 93.98,69.19 93.07,70.1 v93.07,78.49 | v85.45,95.86 84.53,95.86 79.05,101.35 v42.77,101.35 | V18.6 v33.02,111.1
N$60
  Top 0.152: V12.6 68.22,121.01 64.41,121.01 63.8,120.4 63.8,119.02 62.59,117.81 60.15,117.81 38.51,96.16 34.54,96.16 29.52,91.14 29.52,89.76 8.33,68.58 4.67,68.58 4.37,68.28 4.37,64.77 R5.1
N$61
  Top 0.152: V15.4 18.24,53.8 5.13,53.8 4.37,54.56 R6.1
N$62  (via drill 0.35)
  Top 0.152: v4.37,75.74 4.37,73.76 R3.1
  Bottom 0.152: v4.37,75.74 4.37,83.82 19.91,99.37 26.47,99.37 44.91,117.81 60.15,117.81 60.91,118.57 60.91,120.55 63.2,122.83 81.94,122.83 83.46,121.31 100.99,121.31 102.82,119.48 V20.6
N$63  (via drill 0.35)
  Top 0.152: v170.33,92.35 167.89,89.92 167.89,88.39 166.83,87.33 163.47,87.33 161.95,88.85 161.34,88.85 V10.2 | v165.15,127.71 165.15,126.19 167.44,123.9 200.05,123.9 204.47,119.48 V19.5 | v62.89,93.27 61.21,91.59 61.21,88.39 56.19,83.36 56.19,70.1 57.1,69.19 57.1,63.55 V14.1 | v26.62,97.38 26.62,98.6 22.96,102.26 22.96,119.33 V18.2 | v73.41,112.32 73.41,100.13 69.9,96.62 V6.9
  Bottom 0.152: v170.33,92.35 195.17,92.35 199.29,96.47 V7.12 199.44,96.62 204.47,101.65 V19.5 | v165.15,127.71 164.24,128.63 163.47,128.63 161.95,127.1 161.34,127.1 V13.13 | V6.9 69.75,96.47 69.75,94.49 68.53,93.27 v62.89,93.27 30.43,93.27 26.62,97.08 v26.62,97.38 | v73.41,112.32 83.92,112.32 100.08,96.16 100.08,94.79 101.3,93.57 119.28,93.57 122.94,89.92 122.94,87.48 123.7,86.72 158.6,86.72 160.73,88.85 161.19,88.85 V10.2
N$64  (via drill 0.35)
  Top 0.152: 158.75,88.85 159.36,88.85 164.69,83.52 166.68,83.52 170.49,87.33 v191.82,87.33 | V7.13 196.85,94.03 201.88,89 V7.4 | CNB.0B 35.46,3.81 33.78,5.49 33.78,12.8 31.04,15.54 31.04,21.49 R8.1 30.89,21.64 30.58,21.64 12.45,39.78 v12.45,46.48 | v21.59,96.77 21.59,120.09 22.5,121.01 25.71,121.01 27.23,119.48 27.84,119.48 V18.4 | v152.65,82.75 158.75,88.85 | 158.75,88.85 V10.1
  Bottom 0.152: v191.82,87.33 200.35,87.33 V7.4 | v21.59,96.77 21.59,93.42 19.3,91.14 19.3,89.15 19.91,88.54 | 19.91,88.54 54.81,88.54 55.12,88.85 | 55.12,88.85 56.79,90.53 58.17,90.53 59.69,89 V6.2 | v12.45,46.48 12.45,81.08 19.91,88.54 | v152.65,82.75 114.71,82.75 113.79,81.84 77.06,81.84 70.81,88.09 70.81,89.92 70.21,90.53 69.44,90.53 68.22,89.31 68.22,87.78 67.46,87.02 56.95,87.02 55.12,88.85
N$65  (via drill 0.35)
  Top 0.152: v60.3,121.31 V12.3 | v70.21,93.42 69.6,93.42 68.22,94.79 v68.22,113.39 | 170.94,83.52 163.93,76.5 163.93,71.17 V16.12 | v170.94,86.41 170.94,83.52 | v208.28,88.24 208.28,89.61 210.57,91.9 210.57,128.02 209.96,128.63 198.98,128.63 197.46,127.1 196.85,127.1 V19.13 | v172.47,83.21 171.25,83.21 170.94,83.52 | v130.25,85.65 v98.09,85.65
  Bottom 0.152: v60.3,121.31 31.04,121.31 25.4,126.95 V18.12 | V12.3 v68.22,113.39 | V6.4 64.87,89 65.48,89 69.9,93.42 v70.21,93.42 71.88,93.42 73.71,95.25 75.69,95.25 85.29,85.65 v98.09,85.65 | v170.94,86.41 168.81,86.41 166.37,88.85 | v208.28,88.24 203.25,83.21 v172.47,83.21 | v130.25,85.65 163.17,85.65 166.37,88.85 | 166.37,88.85 V10.4
N$66  (via drill 0.35)
  Top 0.152: 172.47,98.15 170.49,98.15 168.96,96.62 V10.10 | 172.47,98.15 174.29,98.15 177.5,94.95 195.33,94.95 200.66,89.61 200.66,70.41 199.44,69.19 176.89,69.19 171.55,63.86 171.55,63.55 V16.6 | 172.47,98.15 172.47,95.56 171.55,94.64 158.6,94.64 157.53,95.71 v157.53,123.9 157.53,127.71 159.06,129.23 171.7,129.23 172.77,128.17 172.77,125.88 172.01,125.12 168.81,125.12 166.98,126.95 166.37,126.95 V13.11 | v69.14,94.79 72.95,94.79 73.71,94.03 74.32,94.03 80.26,99.97 80.26,102.41 96.88,119.02 96.88,122.68 v98.09,123.9
  Bottom 0.152: V21.10 30.58,97.69 31.19,97.69 33.93,94.95 60.6,94.95 62.13,96.47 V6.12 62.28,96.47 62.89,96.47 64.57,94.79 v69.14,94.79 | v157.53,123.9 v98.09,123.9
N$67
  Top 0.152: V22.5 99.16,87.63 99.16,93.42 100.69,94.95 100.69,96.32 121.87,117.5 127.05,117.5 128.57,119.02 128.57,123.44 132.08,126.95 V8.10 132.08,127.1 134.52,127.1 V8.9
N$68  (via drill 0.35)
  Top 0.152: 232.66,122.38 230.68,124.36 230.38,124.36 R14.1 | 232.66,122.38 248.51,122.38 250.19,120.7 A0B.0B | V1.2 V1.1 v153.11,39.93 | V5.1 122.02,63.4 122.63,63.4 124.16,61.87 130.56,61.87 132.08,63.4 V5.5 | v232.66,112.93 232.66,122.38
  Bottom 0.152: v153.11,39.93 129.49,39.93 128.57,40.84 128.57,59.89 132.08,63.4 V5.5 | v232.66,112.93 232.66,84.58 180.7,32.61 173.69,32.61 172.47,33.83 172.47,35.2 171.7,35.97 163.02,35.97 161.34,34.29 V1.2
N$69  (via drill 0.35)
  Top 0.152: 231.14,110.95 230.38,111.71 R16.1 | 231.14,110.95 236.78,110.95 240.89,115.06 248.51,115.06 250.19,116.74 A1B.0A | V5.9 134.67,71.17 135.28,71.17 136.8,72.7 161.65,72.7 v162.56,71.78 162.87,71.48 162.87,42.82 163.78,41.91 V1.12 | v231.14,106.98 231.14,110.95 | v200.05,75.89 200.05,74.37 196.85,71.17 V4.13
  Bottom 0.152: V1.12 V1.13 | v162.56,71.78 163.78,73 194.41,73 196.24,71.17 196.85,71.17 V4.13 | v200.05,75.89 v231.14,106.98
N$70  (via drill 0.35)
  Top 0.152: A2B.0B 250.19,92.81 248.51,94.49 232.36,94.49 230.38,96.47 R18.1 230.23,96.47 227.33,96.47 202.03,71.17 V4.11 | v136.65,46.48 157.23,67.06 v157.23,67.21
  Bottom 0.152: v136.65,46.48 V2.10 | v157.23,67.21 195.63,67.21 196.85,65.99 | 196.85,65.99 199.29,63.55 V4.3 | 196.85,65.99 201.88,71.02 V4.11
N$71  (via drill 0.35)
  Top 0.152: A3B.0B 250.19,78.79 248.51,80.47 232.66,80.47 230.68,82.45 230.38,82.45 R20.1 230.38,82.6 230.38,86.11 230.68,86.41 231.6,86.41 231.9,86.72 231.9,87.48 231.6,87.78 219.1,87.78 202.95,71.63 202.95,70.1 199.44,66.6 v175.21,66.6 | V9.1 20.83,34.29 22.5,35.97 28.75,35.97 30.43,34.29 V9.5 30.58,34.29 32.56,32.31 59.23,32.31 | V3.5 66.7,34.29 64.72,32.31 59.23,32.31 | v150.06,66.6 143.21,66.6 107.7,31.09 59.54,31.09 59.23,31.39 59.23,32.31
  Bottom 0.152: v150.06,66.6 v175.21,66.6
N$72  (via drill 0.35)
  Top 0.152: v167.28,92.35 164.69,89.76 | 164.69,89.76 V10.3 | v199.44,122.83 199.44,122.07 202.03,119.48 V19.4 200.05,117.5 171.4,117.5 169.57,119.33 168.96,119.33 V13.5 | v61.67,99.06 63.8,96.93 63.8,91.9 65.79,89.92 65.79,70.1 64.87,69.19 64.87,63.55 V14.4 | v32.41,107.29 32.41,98.45 33.02,97.84 V21.9 | 164.69,89.76 163.32,91.14 143.81,91.14 131.78,79.1 95.66,79.1 89.41,72.85 v76.15,72.85
  Bottom 0.152: V13.2 161.34,119.33 161.95,119.33 163.47,117.81 167.28,117.81 168.81,119.33 V13.5 | v167.28,92.35 169.42,92.35 172.01,94.95 194.72,94.95 195.94,96.16 195.94,113.39 V19.4 | v199.44,122.83 199.44,126.95 V19.12 | V18.10 30.43,127.1 28.91,128.63 22.5,128.63 21.89,128.02 21.89,126.64 20.37,125.12 20.37,119.48 V18.1 v32.41,107.29 | v61.67,99.06 36.22,99.06 35.92,99.37 34.54,99.37 33.02,97.84 V21.9 | v76.15,72.85 68.38,65.08 66.4,65.08 64.87,63.55 V14.4
N$73  (via drill 0.35)
  Top 0.152: V7.1 176.58,71.17 173.99,71.17 V16.8 | V22.2 92,87.63 94.89,84.73 130.4,84.73 130.86,85.19 | 130.86,85.19 130.86,118.11 132.08,119.33 V8.5 | 130.86,85.19 v133.91,82.14
  Bottom 0.152: v133.91,82.14 170.49,82.14 177.19,88.85 194.26,88.85 V7.1
N$74  (via drill 0.35)
  Top 0.152: v198.98,121.62 196.85,119.48 V19.2 196.85,119.33 196.24,119.33 194.72,117.81 177.5,117.81 174.29,121.01 167.89,121.01 166.37,119.48 V13.4 166.37,119.33 164.85,117.81 162.56,117.81 | 160.88,117.81 159.36,119.33 158.75,119.33 V13.1 | 162.56,117.81 160.88,117.81 | 160.88,117.81 158.75,115.67 158.75,108.97 159.66,108.05 159.66,96.16 160.88,94.95 169.27,94.95 170.79,96.47 171.4,96.47 V10.9 | V22.1 88.8,87.63 82.4,81.23 v69.14,81.23 68.53,81.84 68.53,83.06 82.09,96.62 82.09,101.65 98.7,118.26 v98.7,129.23 | 162.56,117.81 162.56,128.17 163.32,128.93 171.55,128.93 172.47,128.02 172.47,126.04 171.86,125.42 170.49,125.42 V13.10
  Bottom 0.152: v198.98,121.62 199.59,122.23 199.75,122.23 204.47,126.95 V19.10 | V14.10 67.31,79.4 v69.14,81.23 | 98.7,128.93 166.98,128.93 V13.10 | 98.7,128.93 35.46,128.93 33.63,127.1 33.02,127.1 V18.9 | 98.7,128.93 v98.7,129.23
N$75  (via drill 0.35)
  Top 0.152: R11.1 88.19,21.49 88.19,19.81 93.98,14.02 S1B.0A | V2.5 v136.8,39.01
  Bottom 0.152: V3.13 V3.2 59.69,32.77 77.67,14.78 77.67,12.95 78.44,12.19 92.3,12.19 93.98,13.87 S1B.0A 93.98,14.02 95.66,15.7 113.49,15.7 V2.5 | V1.10 168.35,41.91 165.46,39.01 v136.8,39.01
N$76
  Top 0.152: 77.83,14.94 78.74,14.02 S0B.0A | 77.83,14.94 74.17,18.59 74.17,21.49 R10.1 | 122.02,34.29 122.02,37.03 126.9,41.91 V2.12 | V1.4 165.76,34.29 164.08,32.61 123.7,32.61 122.02,34.29 | 122.02,34.29 V2.1 115.47,34.29 108,26.82 97.33,26.82 95.96,25.45 88.34,25.45 77.83,14.94
  Bottom 0.152: V3.9 69.29,41.91 67.61,43.59 61.98,43.59 61.21,42.82 61.21,31.7 78.74,14.17 S0B.0A
N$77  (via drill 0.35)
  Top 0.152: v69.14,82.14 70.81,82.14 85.14,96.47 85.75,96.47 92.91,89.31 94.74,89.31 96.42,87.63 V22.4 97.03,87.63 98.7,85.95 101.91,85.95 103.12,87.17 103.12,92.2 129.49,118.57 129.49,119.33 V8.4 | V13.9 171.4,127.1 170.79,127.1 169.27,128.63 163.47,128.63 162.87,128.02 162.87,120.4 163.78,119.48 V13.3 165.76,121.31 174.45,121.31 176.28,119.48 194.26,119.48 V19.1
  Bottom 0.152: V14.13 59.69,72.7 v69.14,82.14 | V8.4 129.64,119.48 130.25,119.48 131.78,121.01 162.25,121.01 163.78,119.48 V13.3 | V13.9 173.38,128.93 204.47,128.93 206.3,127.1 206.91,127.1 V19.9
N$78
  Top 0.152: MB.0B 50.39,5.49 50.39,12.65 46.28,16.76 46.28,21.49 R9.1
  Bottom 0.152: MB.0B 49.94,3.81 38.05,15.7 33.78,15.7 3.76,45.72 3.76,83.67 19.76,99.67 25.71,99.67 45.36,119.33 57.1,119.33 V12.1
N$79  (via drill 0.35)
  Top 0.152: V11.1 89.41,34.29 95.35,40.23 99.31,40.23 100.69,41.61 100.69,42.98 105.87,48.16 | 105.87,48.16 112.72,55.02 v129.49,55.02 | B0B.0B 248.51,62.64 231.44,62.64 230.68,63.4 230.38,63.4 R15.1 230.23,63.4 v229.31,62.48 | v114.55,39.47 105.87,48.16 | v120.65,33.38 121.72,32.31 166.83,32.31 168.81,34.29 V1.5
  Bottom 0.152: v129.49,55.02 129.49,58.98 132.99,62.48 132.99,64.62 132.54,65.08 131.17,65.08 129.64,63.55 V5.4 | V1.5 169.42,34.29 171.4,32.31 199.14,32.31 v229.31,62.48 | v120.65,33.38 v114.55,39.47
N$80  (via drill 0.35)
  Top 0.152: B1B.0A 248.06,57.15 239.52,48.62 231.29,48.62 230.38,49.53 R17.1 211.33,49.53 197.46,63.4 196.85,63.4 V4.2 | v130.71,40.54 V2.2
  Bottom 0.152: V11.3 94.59,34.29 96.27,32.61 122.78,32.61 V2.2 | v130.71,40.54 131.47,40.54 131.78,40.23 137.41,40.23 150.06,52.88 150.06,65.68 150.37,65.99 194.41,65.99 196.85,63.55 V4.2
N$81  (via drill 0.35)
  Top 0.152: B2B.0B 250.19,33.07 248.51,34.75 231.14,34.75 230.38,35.51 R19.1 230.23,35.66 222.76,35.66 196.24,62.18 | 196.24,62.18 195.94,62.48 195.94,64.62 196.39,65.08 198.53,65.08 204.47,71.02 V4.10 | V2.13 125.07,41.91 126.75,43.59 v157.99,43.59 | 196.24,62.18 v195.78,61.72
  Bottom 0.152: V11.5 99.62,34.29 105.56,40.23 122.78,40.23 V2.13 | v157.99,43.59 171.7,43.59 173.08,42.22 173.08,40.84 173.69,40.23 174.29,40.23 v195.78,61.72
N$82  (via drill 0.35)
  Top 0.152: B3B.0A 250.19,29.11 241.81,20.73 231.44,20.73 230.68,21.49 230.38,21.49 R21.1 230.23,21.64 v164.24,21.64 | v55.58,34.75 60.45,39.62 65.02,39.62 V3.10 68.99,40.23 v90.17,40.23 | v115.77,33.68 v127.81,21.64 | V11.9 v107.09,36.42
  Bottom 0.152: V9.4 28.45,34.29 30.12,32.61 53.44,32.61 v55.58,34.75 | V11.9 100.99,41.91 99.31,40.23 v90.17,40.23 | v127.81,21.64 v164.24,21.64 | v115.77,33.68 109.83,33.68 v107.09,36.42
N$83  (via drill 0.35)
  Top 0.152: 119.89,20.73 119.89,15.54 122.78,12.65 122.78,5.49 S3B.0B | 119.89,20.73 119.89,21.49 R13.1 119.74,21.64 v119.74,25.3 | 119.89,20.73 162.41,20.73 194.26,52.58 194.26,63.4 V4.1
  Bottom 0.152: V4.9 200.97,65.08 200.97,63.09 199.75,61.87 196.54,61.87 195.02,63.4 194.41,63.4 V4.1 | V9.3 26.01,34.29 44.3,16 74.17,16 84.38,5.79 115.32,5.79 118.97,2.13 122.78,2.13 S3B.0B | v119.74,25.3 125.68,31.24 125.68,42.52 126.9,43.74 126.9,63.4 V5.3
N$84  (via drill 0.35)
  Top 0.152: 103.43,20.73 103.43,16.76 107.54,12.65 107.54,5.49 S2B.0B | 103.43,20.73 103.43,21.49 R12.1 | v116.84,24.69 109.53,24.69 105.56,20.73 103.43,20.73
  Bottom 0.152: 132.08,71.17 130.56,72.7 129.18,72.7 128.57,72.08 128.57,70.71 124.46,66.6 V5.2 124.46,43.89 125.37,42.98 125.37,33.22 v116.84,24.69 | 132.08,71.17 134.52,73.61 206.45,73.61 207.97,72.08 207.97,70.1 202.03,64.16 202.03,63.55 V4.4 | 132.08,71.17 V5.10 | V9.2 23.42,34.29 42.01,15.7 69.6,15.7 79.81,5.49 107.54,5.49 S2B.0B
N$85  (via drill 0.35)
  Top 0.152: v159.36,109.27 188.62,109.27 201.27,96.62 201.88,96.62 V7.11
  Bottom 0.152: v159.36,109.27 134.52,109.27 124.46,119.33 V8.2
N$86
  Top 0.152: V23.10 132.08,116.89 134.52,119.33 V8.6
N$87
  Top 0.152: V17.12 93.98,71.02 101.6,63.4 V17.6
N$88
  Top 0.152: F2.A 5.13,105.92 5.13,103.63 5.89,102.87 R2.2
N$89
  Top 0.152: A=B.A 5.13,76.66 5.13,74.52 5.89,73.76 R3.2
N$90
  Top 0.152: F1.A 5.13,95.71 5.13,93.57 5.89,92.81 R4.2
N$91
  Top 0.152: P.A 5.13,67.82 5.13,65.53 5.89,64.77 R5.2
N$92
  Top 0.152: F0.A 5.13,86.87 5.13,84.58 5.89,83.82 R35.2
N$93
  Top 0.152: CN+4.A 5.13,57.61 5.13,55.47 5.89,54.71 R6.2
N$94
  Top 0.152: G.A 5.13,47.4 5.13,45.26 5.89,44.5 R7.2
N$95
  Top 0.152: CN.A 31.8,24.54 31.8,22.4 32.56,21.64 R8.2
N$96
  Top 0.152: M.A 47.04,24.54 47.04,22.4 47.8,21.64 R9.2
N$97
  Top 0.152: S0.A 74.93,22.4 75.69,21.64 R10.2
N$98
  Top 0.152: S1.A 88.95,24.54 88.95,22.4 89.71,21.64 R11.2
N$99
  Top 0.152: S2.A 104.19,24.54 104.19,22.4 104.95,21.64 R12.2
N$100
  Top 0.152: S3.A 120.65,22.4 121.41,21.64 R13.2
N$101
  Top 0.152: A0.A 231.14,125.27 231.9,124.51 R14.2
N$102
  Top 0.152: B0.A 231.14,64.31 231.9,63.55 R15.2
N$103
  Top 0.152: A1.A 231.14,112.62 231.9,111.86 R16.2
N$104
  Top 0.152: B1.A 231.14,50.29 231.9,49.53 R17.2
N$105
  Top 0.152: A2.A 231.14,97.38 231.9,96.62 R18.2
N$106
  Top 0.152: B2.A 231.14,36.42 231.9,35.66 R19.2
N$107
  Top 0.152: A3.A 231.14,83.36 231.9,82.6 R20.2
N$108
  Top 0.152: B3.A 231.14,22.4 231.9,21.64 R21.2
N$109  (1 unrouted)
VCC  (via drill 0.35)
  Top 0.152: V15.7 36.52,64.47 36.52,72.08 35.61,73 35.61,90.07 V21.7 | 88.95,32.61 99.31,32.61 100.69,33.98 100.69,35.36 101.3,35.97 102.36,35.97 104.04,34.29 V11.7 110.29,34.29 120.19,44.2 | 88.95,32.61 88.65,32.61 86.97,34.29 V3.7 72.34,34.29 70.66,35.97 64.41,35.97 63.8,35.36 63.8,33.83 62.59,32.61 56.79,32.61 55.12,34.29 V9.7 | 120.19,44.2 137.11,61.11 137.11,63.4 V5.7 | 120.19,44.2 v113.79,50.6 | V16.7 173.99,43.89 174.9,42.98 174.9,35.2 V1.7 | S2B.1A 104.04,13.87 100.99,13.87 99.31,12.19 90.63,12.19 88.95,13.87 S1B.1A 87.12,12.19 78.44,12.19 76.76,13.87 73.71,13.87 S0B.1A 73.56,13.87 71.12,13.87 59.38,2.13 51.61,2.13 49.94,3.81 MB.1B | v88.95,32.31 88.95,32.61 | v69.6,122.23 69.29,122.53 56.03,122.53 52.98,119.48 35.61,119.48 V18.7 | V20.7 105.41,119.94 99.31,126.04 99.31,129.54 99.01,129.84 98.4,129.84 96.27,127.71 96.27,122.38 93.98,120.09 93.98,118.26 93.22,117.5 74.32,117.5 72.49,119.33 V12.7 | V8.7 136.19,118.42 136.19,96.16 134.98,94.95 134.67,94.95 131.17,91.44 131.17,87.78 131.62,87.33 134.98,87.33 136.5,88.85 137.11,88.85 V23.7 | V22.7 121.26,87.63 121.56,87.33 v128.73,87.33 | V4.7 209.65,63.4 227.48,63.4 231.6,59.28 243.33,59.28 245.01,60.96 B0B.1B | v172.62,90.37 173.99,89 V10.7
  Bottom 0.152: V15.7 34.54,62.48 34.54,41 35.46,40.08 35.46,34.29 V9.7 | 102.51,61.87 93.67,61.87 92.76,62.79 92.76,71.78 91.85,72.7 88.49,72.7 79.35,63.55 72.49,63.55 V14.7 | V17.7 102.51,61.87 | v113.79,50.6 102.51,61.87 | MB.1B 43.99,3.81 35.61,12.19 32.26,12.19 CNB.1A | S3B.1B 117.75,3.81 114.4,7.16 113.34,7.16 111.66,8.84 | 111.66,8.84 106.63,13.87 104.19,13.87 S2B.1A | 111.66,8.84 137.11,34.29 V2.7 156.77,34.29 158.75,36.27 172.01,36.27 V1.7 180.39,34.29 209.5,63.4 V4.7 | v88.95,32.31 88.95,14.02 S1B.1A | v69.6,122.23 72.34,119.48 V12.7 | V6.7 72.49,88.85 81.64,88.85 85.45,85.04 101.45,85.04 104.04,87.63 V22.7 | V20.7 105.41,108.51 123.55,90.37 123.55,87.78 124,87.33 124.92,87.33 125.98,88.39 125.98,89.92 126.59,90.53 127.36,90.53 128.57,89.31 128.57,87.48 v128.73,87.33 135.59,87.33 V23.7 137.26,89 156.92,89 159.06,91.14 171.86,91.14 v172.62,90.37 | V13.7 173.99,119.48 192.43,119.48 193.95,121.01 207.97,121.01 209.5,119.48 V19.7 | 207.67,90.83 178.71,90.83 176.89,89 173.99,89 V10.7 | 207.67,90.83 209.5,89 V7.7 | 209.65,118.57 209.65,108.36 210.87,107.14 210.87,94.03 207.67,90.83 | 209.65,118.57 209.65,119.33 V19.7 | 244.09,118.57 244.09,119.63 A0B.1B | 244.09,118.57 244.09,115.82 245.01,114.91 245.01,106.68 A1B.1B 245.16,106.68 246.07,105.77 246.07,101.8 245.16,100.89 245.16,92.81 A2B.1B 246.07,91.75 246.07,87.78 245.16,86.87 245.16,78.79 A3B.1B 245.16,78.64 245.16,73.15 246.07,72.24 246.07,61.87 245.16,60.96 | B3B.1B 245.01,19.05 245.01,27.28 244.09,28.19 244.09,32 B2B.1B 245.16,33.07 245.16,41.15 246.07,42.06 246.07,46.02 B1B.1B 245.16,47.09 245.16,55.17 246.07,56.08 246.07,60.05 245.16,60.96
  Bottom 0.152: 245.16,60.96 B0B.1B | 244.09,118.57 209.65,118.57 | 209.65,118.57 V19.7